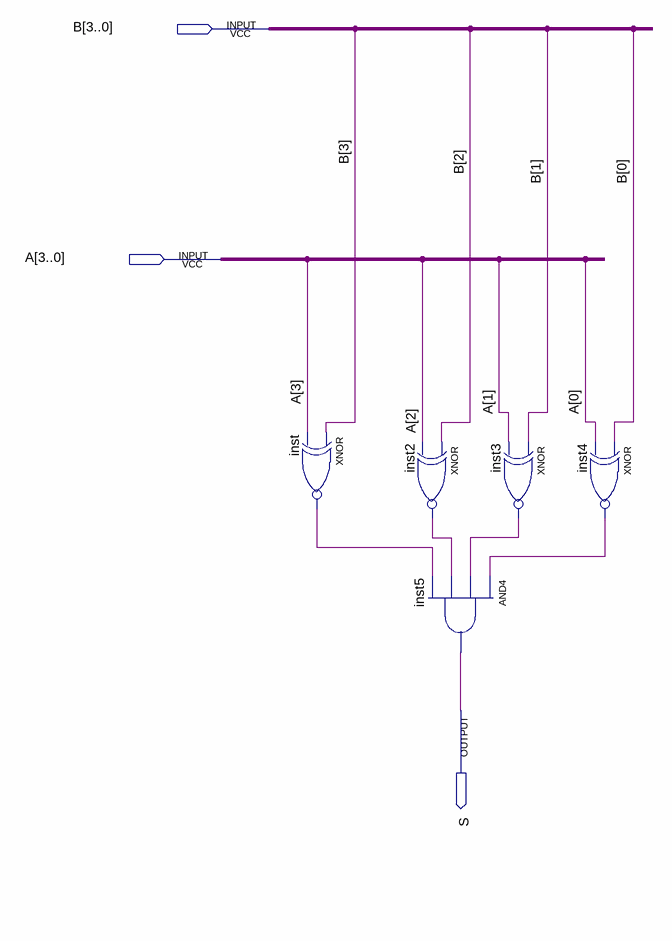
[diagram p0: schematic sheet]
// Quartus schematic comparador_igual.bdf as structural Verilog: 5 symbols, 3 pins
module comparador_igual (
  input  [3:0] B,
  input  [3:0] A,
  output S
);

  wire inst2_out, inst3_out, inst4_out, inst_out;

  xnor inst (inst_out, B[3], A[3]);
  xnor inst2 (inst2_out, B[2], A[2]);
  and inst5 (S, inst4_out, inst3_out, inst2_out, inst_out);
  xnor inst3 (inst3_out, B[1], A[1]);
  xnor inst4 (inst4_out, B[0], A[0]);
endmodule
